# EAGLE design ltc2400_adc_module (EAGLE 7.4.0)
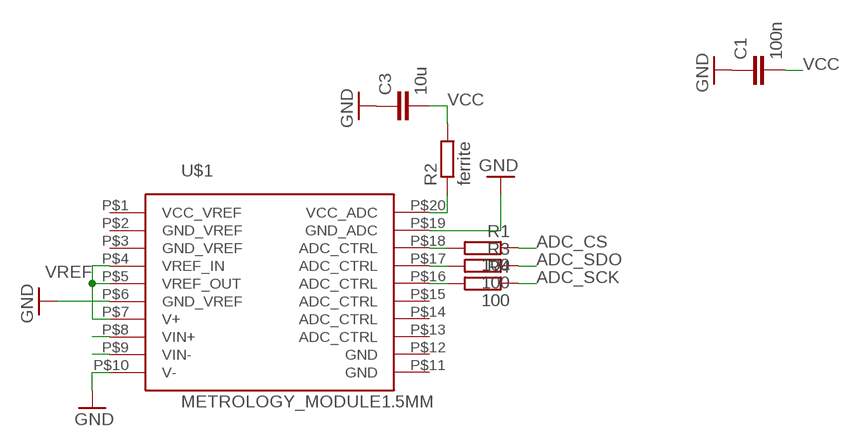
[diagram p0: schematic, sheet 1]

## Parts
C1  100n  C-EUC0603  [C0603]
C3  10u  C-EUC0805  [C0805]
R1  100  R-EU_R0603  [R0603]
R2  ferrite  R-EU_R0805  [R0805]
R3  100  R-EU_R0603  [R0603]
R4  100  R-EU_R0603  [R0603]
U$1  METROLOGY_MODULE1.5MM  [METROLOGY_MODULE_1.5MM_HOLE]

## Nets
ADC_CS: R1.1
ADC_SCK: R4.1
ADC_SDO: R3.1
GND: C1.1 C3.1 U$1.P$6(GND_VREF) U$1.P$10(V-) U$1.P$19(GND_ADC)
N$1: R2.1 U$1.P$20(VCC_ADC)
N$2: R1.2 U$1.P$18(ADC_CTRL)
N$3: R3.2 U$1.P$17(ADC_CTRL)
N$4: R4.2 U$1.P$16(ADC_CTRL)
N$5: U$1.P$8(VIN+)
N$6: U$1.P$9(VIN-)
VCC: C1.2 C3.2 R2.2
VREF: U$1.P$4(VREF_IN) U$1.P$5(VREF_OUT) U$1.P$7(V+)
Unconnected: U$1.P$1(VCC_VREF) U$1.P$2(GND_VREF) U$1.P$3(GND_VREF) U$1.P$11(GND) U$1.P$12(GND) U$1.P$13(ADC_CTRL) U$1.P$14(ADC_CTRL) U$1.P$15(ADC_CTRL)

## Library data of the parts
C1 C3 = SquantorRCL:C-EU: CAPACITOR, European symbol
R1-R4 = SquantorRCL:R-EU_: RESISTOR, European symbol
U$1 = SquantorPCBOutline:METROLOGY_MODULE

## Board
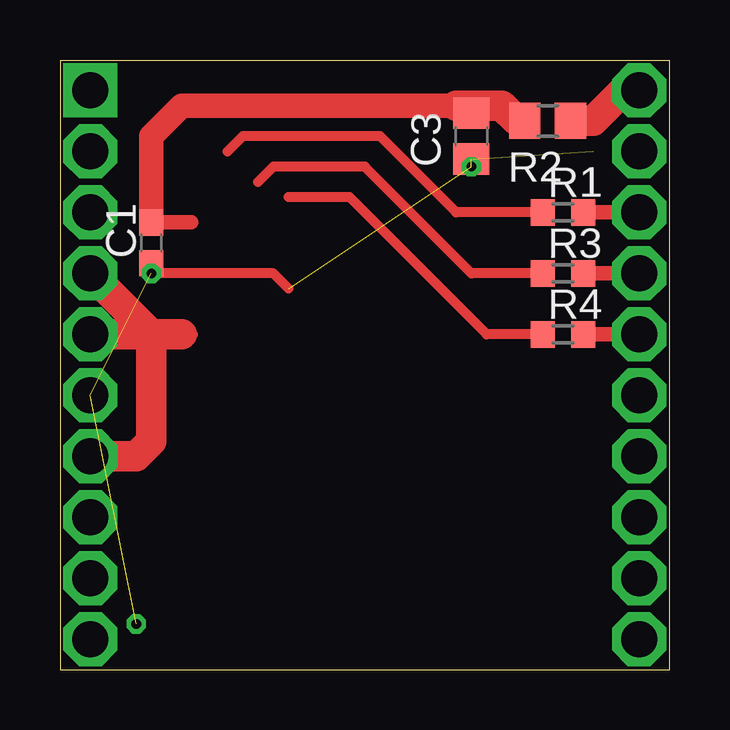
[diagram p1: board, top side]
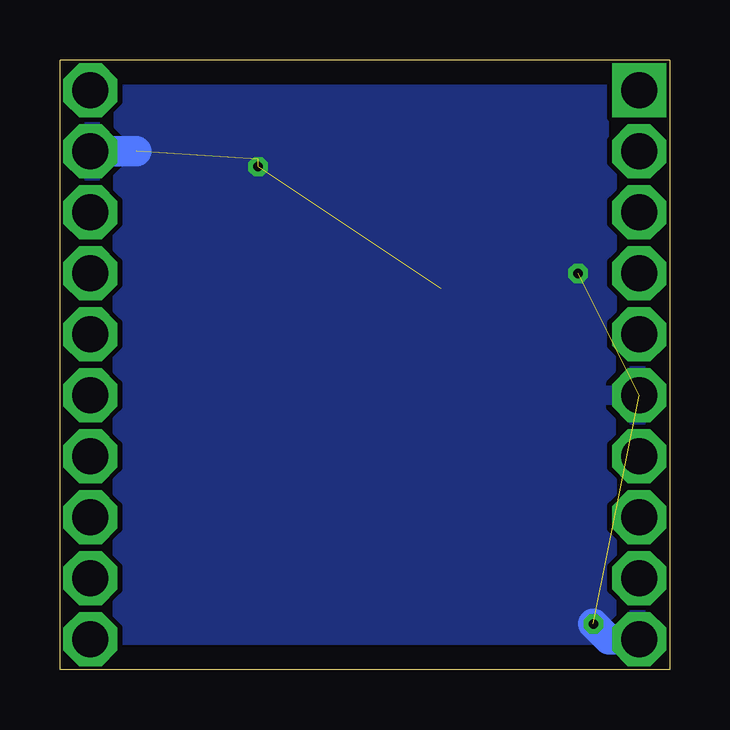
[diagram p2: board, bottom side, seen from below]

Size 25.4 x 25.4 mm. Coordinates in mm from the lower left corner, seen from the top.
Outline: 0,25.4 25.4,25.4
Copper layers (1*16): Top 0.035mm / dielectric 1.5mm / Bottom 0.035mm
Design rules "default": minimum track width 10mil, minimum drill 24mil, track to track 8mil, track to pad 8mil, pad to pad 8mil, via to via 8mil, smd to smd 8mil, copper to edge 40mil, drill to drill 8mil, minimum pad ring 10mil, minimum via ring 8mil, stop-mask expansion 4mil, vias tented up to drill 0mil, thermal gap 10mil

### Footprints (pad centres in the part's own frame; a part is rotated, then mirrored left to right if it is on the bottom)
C0603 = smd 1.1 x 1: 1 -0.85,0; 2 0.85,0
C0805 = smd 1.3 x 1.5: 1 -0.95,0; 2 0.95,0
R0603 = smd 1 x 1.1: 1 -0.85,0; 2 0.85,0
R0805 = smd 1.3 x 1.5: 1 -0.95,0; 2 0.95,0
METROLOGY_MODULE_1.5MM_HOLE = drill 1.5 pad 1.8 square: P$1 -11.43,11.43 | drill 1.5 pad 1.8 octagon: P$2 -11.43,8.89; P$3 -11.43,6.35; P$4 -11.43,3.81; P$5 -11.43,1.27; P$6 -11.43,-1.27; P$7 -11.43,-3.81; P$8 -11.43,-6.35; P$9 -11.43,-8.89; P$10 -11.43,-11.43; P$11 11.43,-11.43; P$12 11.43,-8.89; P$13 11.43,-6.35; P$14 11.43,-3.81; P$15 11.43,-1.27; P$16 11.43,1.27; P$17 11.43,3.81; P$18 11.43,6.35; P$19 11.43,8.89; P$20 11.43,11.43

### Placement (x,y rotation side)
C1  3.81,17.78 90 top
C3  17.14,22.23 90 top
R1  20.95,19.05 0 top
R2  20.32,22.86 180 top
R3  20.95,16.51 0 top
R4  20.95,13.97 0 top
U$1  12.7,12.7 0 top

### Tracks (layer width: path | path; a pad name or v marks a point on that pad's centre or on a via)
ADC_CS
  Top 0.406: R1.1 16.51,19.05 13.34,22.23 7.62,22.23 6.99,21.59
ADC_SCK
  Top 0.406: R4.1 17.78,13.97 12.06,19.68 9.53,19.68
ADC_SDO
  Top 0.406: R3.1 17.14,16.51 12.7,20.95 8.89,20.95 8.26,20.32
GND  (via drill 0.4)  (5 unrouted)
  Top 0.406: 9.53,15.88 8.89,16.51 v3.81,16.51 C1.1
  Bottom 1.27: U$1.P$19 22.23,21.59 | U$1.P$10 2.54,1.27 v3.17,1.91
  other vias: 17.14,20.95
  pour Bottom: 0,25.4 25.4,25.4 25.4,0 0,0
N$1
  Top 1.27: U$1.P$20 23.5,24.13 22.23,22.86 R2.1
N$2
  Top 0.61: U$1.P$18 R1.2
N$3
  Top 0.61: U$1.P$17 R3.2
N$4
  Top 0.61: U$1.P$16 R4.2
VCC
  Top 0.61: C1.2 5.47,18.63
  Top 1.016: 16.51,23.5 5.08,23.5 3.81,22.23 C1.2
  Top 1.27: R2.2 19.05,22.86 18.41,23.5 17.14,23.5 | 17.14,23.5 16.51,23.5 | C3.2 17.14,23.5
VREF
  Top 0.406: 5.08,13.97 5.54,13.97
  Top 1.27: U$1.P$5 3.81,13.97 | 3.81,13.97 5.08,13.97 | U$1.P$4 3.81,13.97 | U$1.P$7 3.17,8.89 3.81,9.53 3.81,13.97